# EAGLE schematic Sensor-Board_dev (EAGLE 9.6.2)

## Sheet 1 of 2
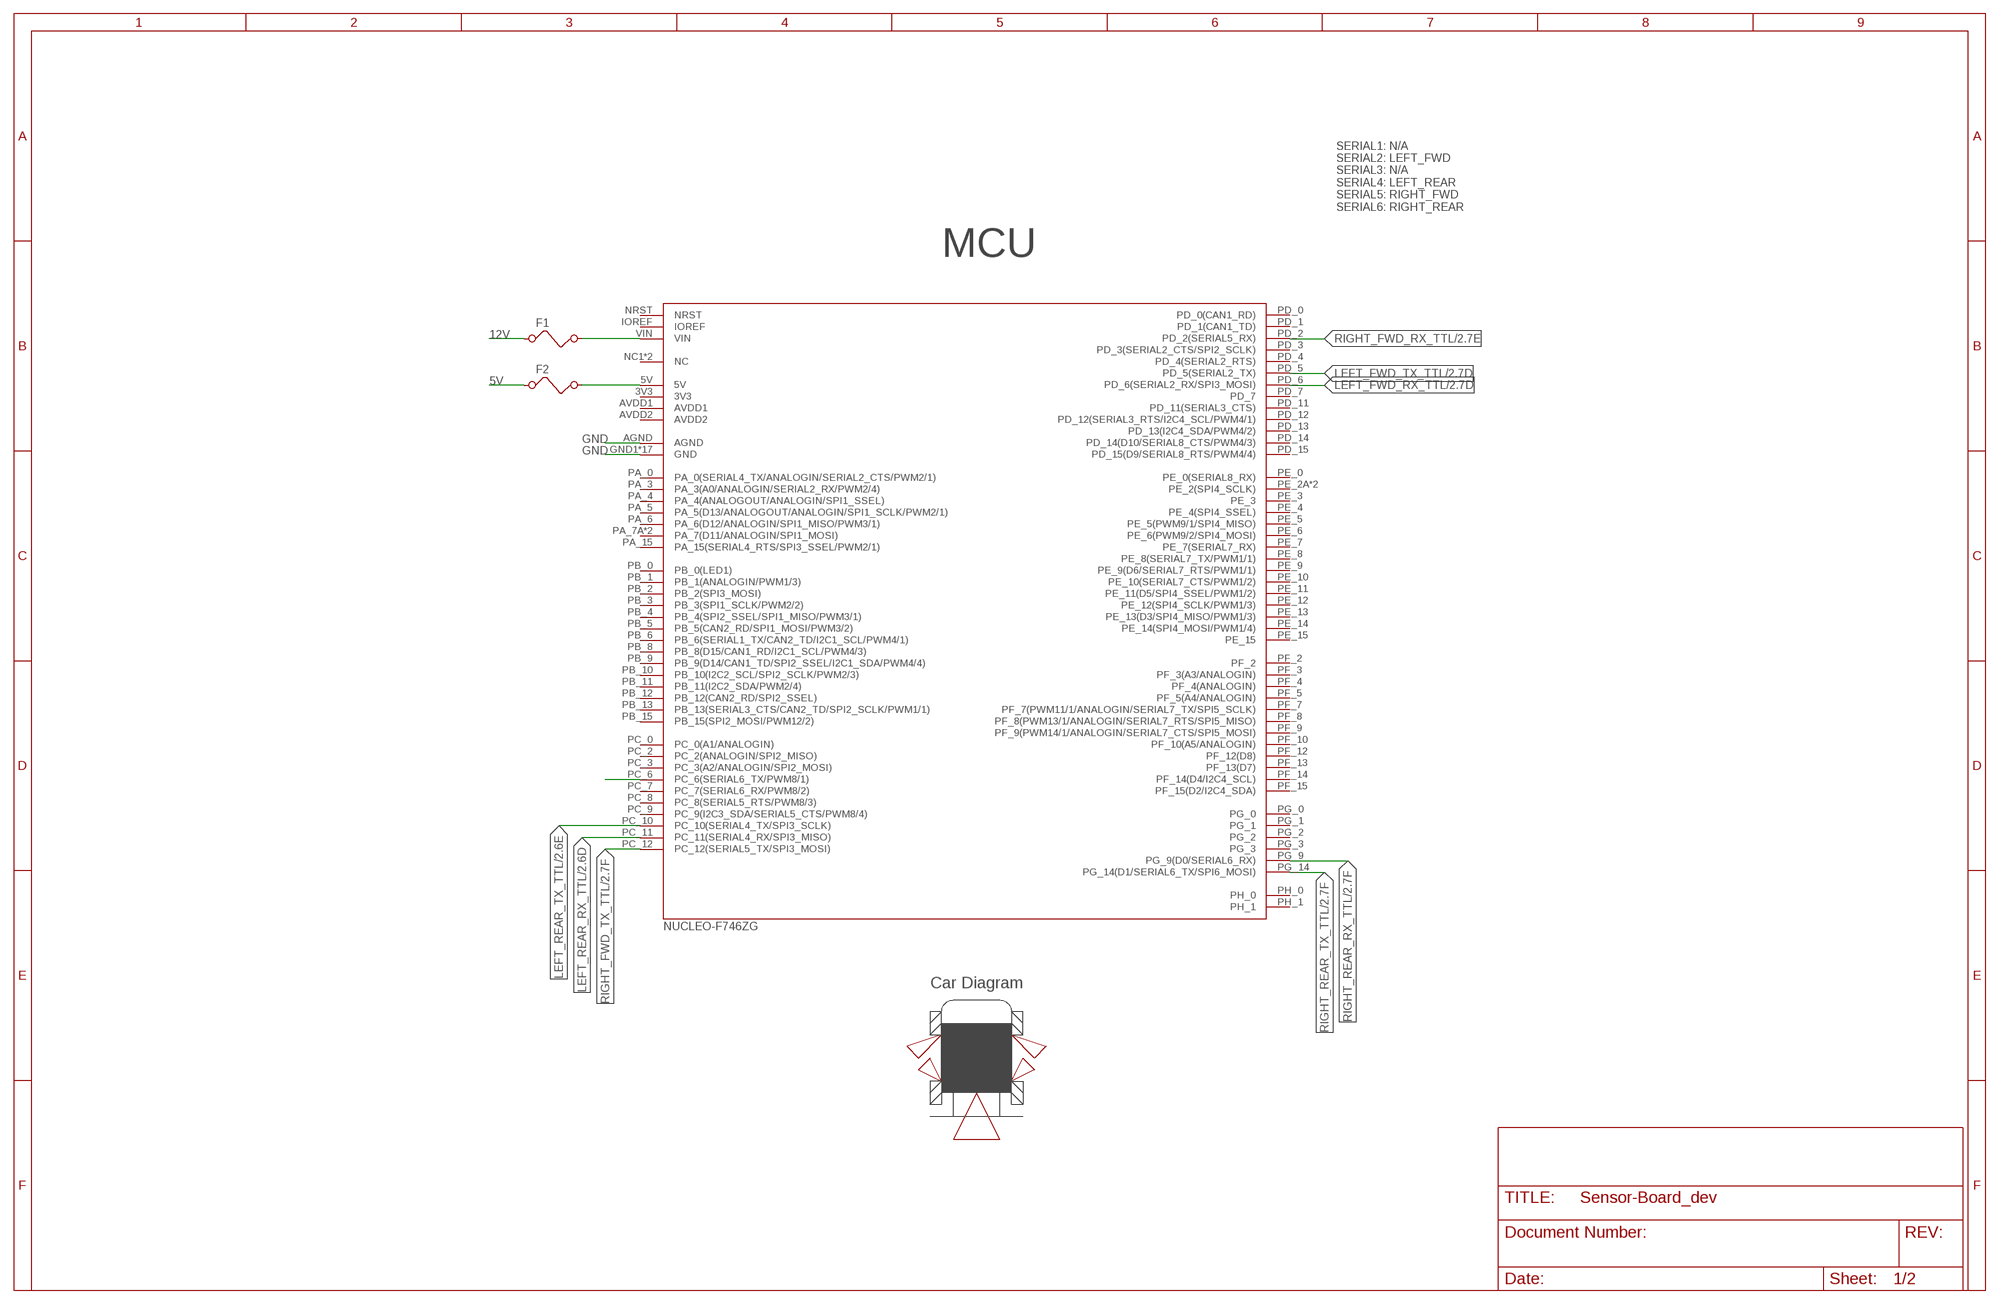
[diagram p0: schematic, sheet 1]

### Parts
F1  FUSE_1210  [1210]
F2  FUSE_1210  [1210]
UC1  NUCLEO-F746ZGNUCLEO-F746ZG  [NUCLEO-F746ZG]

### Nets
5V: F2.1 ; also sheet 2
12V: F1.1 ; also sheet 2
GND: UC1.AGND UC1.GND1(GND) UC1.GND2(GND) UC1.GND3(GND) UC1.GND4(GND) UC1.GND5(GND) UC1.GND6(GND) UC1.GND7(GND) UC1.GND8(GND) UC1.GND9(GND) UC1.GND10(GND) UC1.GND11(GND) UC1.GND12(GND) UC1.GND13(GND) UC1.GND14(GND) UC1.GND15(GND) UC1.GND16(GND) UC1.GND17(GND) ; also sheet 2
LEFT_FWD_RX_TTL: UC1.PD_6(PD_6(SERIAL2_RX/SPI3_MOSI)) ; also sheet 2
LEFT_FWD_TX_TTL: UC1.PD_5(PD_5(SERIAL2_TX)) ; also sheet 2
LEFT_REAR_RX_TTL: UC1.PC_11(PC_11(SERIAL4_RX/SPI3_MISO)) ; also sheet 2
LEFT_REAR_TX_TTL: UC1.PC_10(PC_10(SERIAL4_TX/SPI3_SCLK)) ; also sheet 2
N$8: F1.2 UC1.VIN
N$9: F2.2 UC1.5V
N$10: UC1.PC_6(PC_6(SERIAL6_TX/PWM8/1))
RIGHT_FWD_RX_TTL: UC1.PD_2(PD_2(SERIAL5_RX)) ; also sheet 2
RIGHT_FWD_TX_TTL: UC1.PC_12(PC_12(SERIAL5_TX/SPI3_MOSI)) ; also sheet 2
RIGHT_REAR_RX_TTL: UC1.PG_9(PG_9(D0/SERIAL6_RX)) ; also sheet 2
RIGHT_REAR_TX_TTL: UC1.PG_14(PG_14(D1/SERIAL6_TX/SPI6_MOSI)) ; also sheet 2
Unconnected: UC1.3V3 UC1.AVDD1 UC1.AVDD2 UC1.IOREF UC1.NC1(NC) UC1.NC2(NC) UC1.NRST UC1.PA_0(PA_0(SERIAL4_TX/ANALOGIN/SERIAL2_CTS/PWM2/1)) UC1.PA_3(PA_3(A0/ANALOGIN/SERIAL2_RX/PWM2/4)) UC1.PA_4(PA_4(ANALOGOUT/ANALOGIN/SPI1_SSEL)) UC1.PA_5(PA_5(D13/ANALOGOUT/ANALOGIN/SPI1_SCLK/PWM2/1)) UC1.PA_6(PA_6(D12/ANALOGIN/SPI1_MISO/PWM3/1)) UC1.PA_7A(PA_7(D11/ANALOGIN/SPI1_MOSI)) UC1.PA_7B(PA_7(D11/ANALOGIN/SPI1_MOSI)) UC1.PA_15(PA_15(SERIAL4_RTS/SPI3_SSEL/PWM2/1)) UC1.PB_0(PB_0(LED1)) UC1.PB_1(PB_1(ANALOGIN/PWM1/3)) UC1.PB_2(PB_2(SPI3_MOSI)) UC1.PB_3(PB_3(SPI1_SCLK/PWM2/2)) UC1.PB_4(PB_4(SPI2_SSEL/SPI1_MISO/PWM3/1)) UC1.PB_5(PB_5(CAN2_RD/SPI1_MOSI/PWM3/2)) UC1.PB_6(PB_6(SERIAL1_TX/CAN2_TD/I2C1_SCL/PWM4/1)) UC1.PB_8(PB_8(D15/CAN1_RD/I2C1_SCL/PWM4/3)) UC1.PB_9(PB_9(D14/CAN1_TD/SPI2_SSEL/I2C1_SDA/PWM4/4)) UC1.PB_10(PB_10(I2C2_SCL/SPI2_SCLK/PWM2/3)) UC1.PB_11(PB_11(I2C2_SDA/PWM2/4)) UC1.PB_12(PB_12(CAN2_RD/SPI2_SSEL)) UC1.PB_13(PB_13(SERIAL3_CTS/CAN2_TD/SPI2_SCLK/PWM1/1)) UC1.PB_15(PB_15(SPI2_MOSI/PWM12/2)) UC1.PC_0(PC_0(A1/ANALOGIN)) UC1.PC_2(PC_2(ANALOGIN/SPI2_MISO)) UC1.PC_3(PC_3(A2/ANALOGIN/SPI2_MOSI)) UC1.PC_7(PC_7(SERIAL6_RX/PWM8/2)) UC1.PC_8(PC_8(SERIAL5_RTS/PWM8/3)) UC1.PC_9(PC_9(I2C3_SDA/SERIAL5_CTS/PWM8/4)) UC1.PD_0(PD_0(CAN1_RD)) UC1.PD_1(PD_1(CAN1_TD)) UC1.PD_3(PD_3(SERIAL2_CTS/SPI2_SCLK)) UC1.PD_4(PD_4(SERIAL2_RTS)) UC1.PD_7 UC1.PD_11(PD_11(SERIAL3_CTS)) UC1.PD_12(PD_12(SERIAL3_RTS/I2C4_SCL/PWM4/1)) UC1.PD_13(PD_13(I2C4_SDA/PWM4/2)) UC1.PD_14(PD_14(D10/SERIAL8_CTS/PWM4/3)) UC1.PD_15(PD_15(D9/SERIAL8_RTS/PWM4/4)) UC1.PE_0(PE_0(SERIAL8_RX)) UC1.PE_2A(PE_2(SPI4_SCLK)) UC1.PE_2B(PE_2(SPI4_SCLK)) UC1.PE_3 UC1.PE_4(PE_4(SPI4_SSEL)) UC1.PE_5(PE_5(PWM9/1/SPI4_MISO)) UC1.PE_6(PE_6(PWM9/2/SPI4_MOSI)) UC1.PE_7(PE_7(SERIAL7_RX)) UC1.PE_8(PE_8(SERIAL7_TX/PWM1/1)) UC1.PE_9(PE_9(D6/SERIAL7_RTS/PWM1/1)) UC1.PE_10(PE_10(SERIAL7_CTS/PWM1/2)) UC1.PE_11(PE_11(D5/SPI4_SSEL/PWM1/2)) UC1.PE_12(PE_12(SPI4_SCLK/PWM1/3)) UC1.PE_13(PE_13(D3/SPI4_MISO/PWM1/3)) UC1.PE_14(PE_14(SPI4_MOSI/PWM1/4)) UC1.PE_15 UC1.PF_2 UC1.PF_3(PF_3(A3/ANALOGIN)) UC1.PF_4(PF_4(ANALOGIN)) UC1.PF_5(PF_5(A4/ANALOGIN)) UC1.PF_7(PF_7(PWM11/1/ANALOGIN/SERIAL7_TX/SPI5_SCLK)) UC1.PF_8(PF_8(PWM13/1/ANALOGIN/SERIAL7_RTS/SPI5_MISO)) UC1.PF_9(PF_9(PWM14/1/ANALOGIN/SERIAL7_CTS/SPI5_MOSI)) UC1.PF_10(PF_10(A5/ANALOGIN)) UC1.PF_12(PF_12(D8)) UC1.PF_13(PF_13(D7)) UC1.PF_14(PF_14(D4/I2C4_SCL)) UC1.PF_15(PF_15(D2/I2C4_SDA)) UC1.PG_0 UC1.PG_1 UC1.PG_2 UC1.PG_3 UC1.PH_0 UC1.PH_1

### Notes on the sheet
- SERIAL1: N/A
  SERIAL2: LEFT_FWD
  SERIAL3: N/A
  SERIAL4: LEFT_REAR
  SERIAL5: RIGHT_FWD
  SERIAL6: RIGHT_REAR
- MCU
- Car Diagram

## Sheet 2 of 2
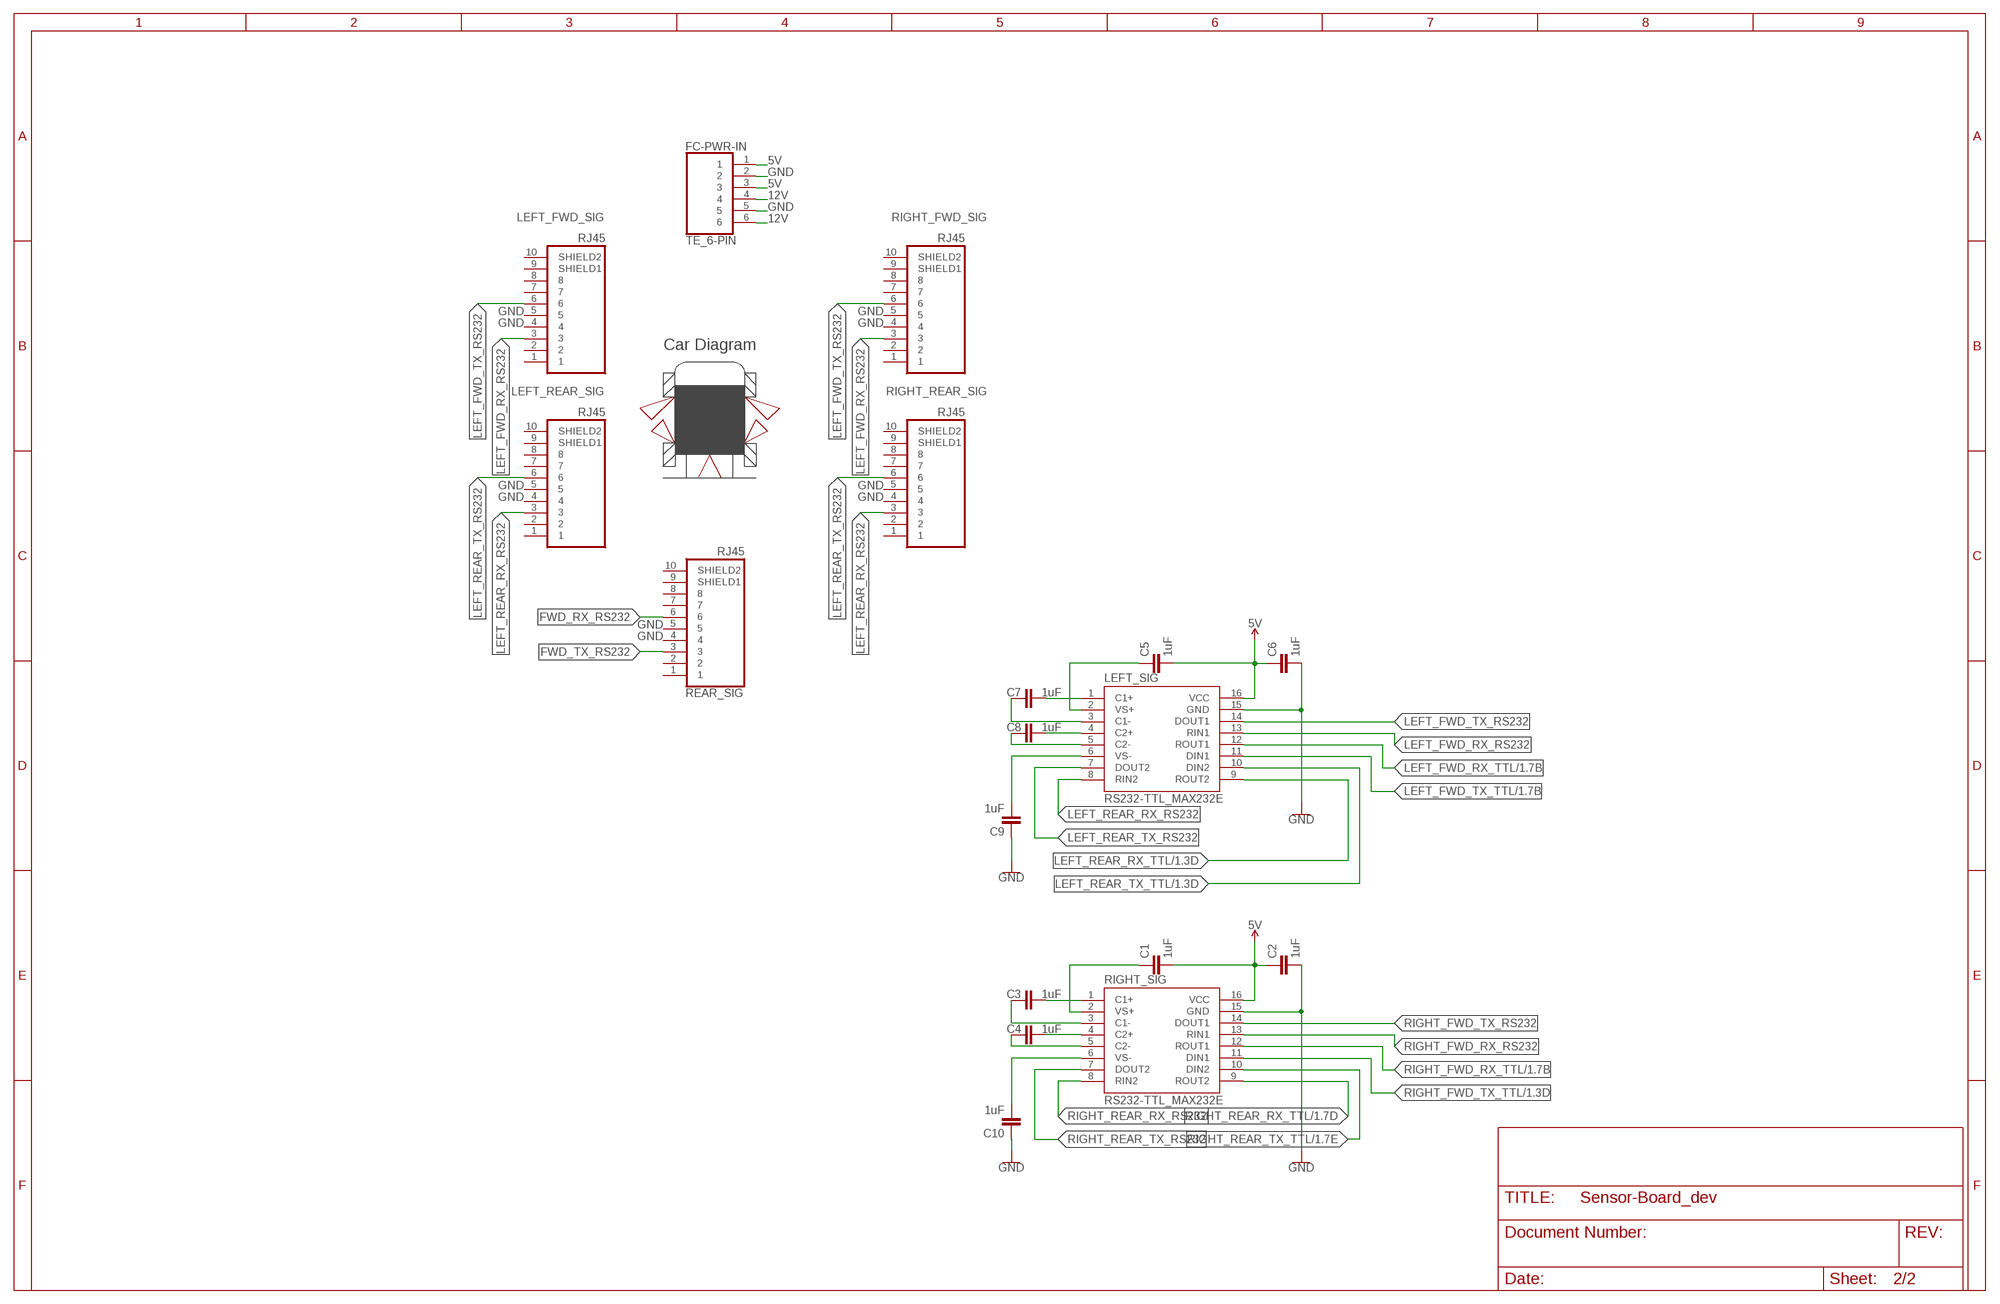
[diagram p1: schematic, sheet 2]

### Parts
C1  1uF  CAPACITOR_CERAMIC_THROUGH-HOLE  [CAP-PTH-5MM]
C2  1uF  CAPACITOR_CERAMIC_THROUGH-HOLE  [CAP-PTH-5MM]
C3  1uF  CAPACITOR_CERAMIC_THROUGH-HOLE  [CAP-PTH-5MM]
C4  1uF  CAPACITOR_CERAMIC_THROUGH-HOLE  [CAP-PTH-5MM]
C5  1uF  CAPACITOR_CERAMIC_THROUGH-HOLE  [CAP-PTH-5MM]
C6  1uF  CAPACITOR_CERAMIC_THROUGH-HOLE  [CAP-PTH-5MM]
C7  1uF  CAPACITOR_CERAMIC_THROUGH-HOLE  [CAP-PTH-5MM]
C8  1uF  CAPACITOR_CERAMIC_THROUGH-HOLE  [CAP-PTH-5MM]
C9  1uF  CAPACITOR_CERAMIC_THROUGH-HOLE  [CAP-PTH-5MM]
C10  1uF  CAPACITOR_CERAMIC_THROUGH-HOLE  [CAP-PTH-5MM]
FC-PWR-IN  TE_6-PIN  [TE_6-PIN]
LEFT_FWD_SIG  RJ45  [RJ45]
LEFT_REAR_SIG  RJ45  [RJ45]
LEFT_SIG  RS232-TTL_MAX232E  [DIP16]
REAR_SIG  RJ45  [RJ45]
RIGHT_FWD_SIG  RJ45  [RJ45]
RIGHT_REAR_SIG  RJ45  [RJ45]
RIGHT_SIG  RS232-TTL_MAX232E  [DIP16]

### Nets
5V: C1.2 C2.1 C5.2 C6.1 FC-PWR-IN.1 FC-PWR-IN.3 LEFT_SIG.16(VCC) RIGHT_SIG.16(VCC) ; also sheet 1
12V: FC-PWR-IN.4 FC-PWR-IN.6 ; also sheet 1
FWD_RX_RS232: REAR_SIG.6
FWD_TX_RS232: REAR_SIG.3
GND: C2.2 C6.2 C9.1 C10.1 FC-PWR-IN.2 FC-PWR-IN.5 LEFT_SIG.15(GND) RIGHT_SIG.15(GND) ; also sheet 1
LEFT_FWD_RX_RS232: LEFT_FWD_SIG.3 LEFT_SIG.13(RIN1) RIGHT_FWD_SIG.3
LEFT_FWD_RX_TTL: LEFT_SIG.12(ROUT1) ; also sheet 1
LEFT_FWD_TX_RS232: LEFT_FWD_SIG.6 LEFT_SIG.14(DOUT1) RIGHT_FWD_SIG.6
LEFT_FWD_TX_TTL: LEFT_SIG.11(DIN1) ; also sheet 1
LEFT_REAR_RX_RS232: LEFT_REAR_SIG.3 LEFT_SIG.8(RIN2) RIGHT_REAR_SIG.3
LEFT_REAR_RX_TTL: LEFT_SIG.9(ROUT2) ; also sheet 1
LEFT_REAR_TX_RS232: LEFT_REAR_SIG.6 LEFT_SIG.7(DOUT2) RIGHT_REAR_SIG.6
LEFT_REAR_TX_TTL: LEFT_SIG.10(DIN2) ; also sheet 1
N$1: C7.2 LEFT_SIG.1(C1+)
N$2: C1.1 RIGHT_SIG.2(VS+)
N$3: C3.1 RIGHT_SIG.3(C1-)
N$4: C4.2 RIGHT_SIG.4(C2+)
N$5: C4.1 RIGHT_SIG.5(C2-)
N$6: C10.2 RIGHT_SIG.6(VS-)
N$7: C3.2 RIGHT_SIG.1(C1+)
N$25: C5.1 LEFT_SIG.2(VS+)
N$27: C7.1 LEFT_SIG.3(C1-)
N$28: C8.2 LEFT_SIG.4(C2+)
N$29: C8.1 LEFT_SIG.5(C2-)
N$30: C9.2 LEFT_SIG.6(VS-)
RIGHT_FWD_RX_RS232: RIGHT_SIG.13(RIN1)
RIGHT_FWD_RX_TTL: RIGHT_SIG.12(ROUT1) ; also sheet 1
RIGHT_FWD_TX_RS232: RIGHT_SIG.14(DOUT1)
RIGHT_FWD_TX_TTL: RIGHT_SIG.11(DIN1) ; also sheet 1
RIGHT_REAR_RX_RS232: RIGHT_SIG.8(RIN2)
RIGHT_REAR_RX_TTL: RIGHT_SIG.9(ROUT2) ; also sheet 1
RIGHT_REAR_TX_RS232: RIGHT_SIG.7(DOUT2)
RIGHT_REAR_TX_TTL: RIGHT_SIG.10(DIN2) ; also sheet 1
Unconnected: LEFT_FWD_SIG.1 LEFT_FWD_SIG.2 LEFT_FWD_SIG.4 LEFT_FWD_SIG.5 LEFT_FWD_SIG.7 LEFT_FWD_SIG.8 LEFT_FWD_SIG.9(SHIELD1) LEFT_FWD_SIG.10(SHIELD2) LEFT_REAR_SIG.1 LEFT_REAR_SIG.2 LEFT_REAR_SIG.4 LEFT_REAR_SIG.5 LEFT_REAR_SIG.7 LEFT_REAR_SIG.8 LEFT_REAR_SIG.9(SHIELD1) LEFT_REAR_SIG.10(SHIELD2) REAR_SIG.1 REAR_SIG.2 REAR_SIG.4 REAR_SIG.5 REAR_SIG.7 REAR_SIG.8 REAR_SIG.9(SHIELD1) REAR_SIG.10(SHIELD2) RIGHT_FWD_SIG.1 RIGHT_FWD_SIG.2 RIGHT_FWD_SIG.4 RIGHT_FWD_SIG.5 RIGHT_FWD_SIG.7 RIGHT_FWD_SIG.8 RIGHT_FWD_SIG.9(SHIELD1) RIGHT_FWD_SIG.10(SHIELD2) RIGHT_REAR_SIG.1 RIGHT_REAR_SIG.2 RIGHT_REAR_SIG.4 RIGHT_REAR_SIG.5 RIGHT_REAR_SIG.7 RIGHT_REAR_SIG.8 RIGHT_REAR_SIG.9(SHIELD1) RIGHT_REAR_SIG.10(SHIELD2)

### Notes on the sheet
- Car Diagram

## Library data of the parts
C1-C10 = EcoCar-Passives:CAPACITOR_CERAMIC_THROUGH-HOLE
F1 F2 = EcoCar-Fuses-Protection:FUSE_1210: 1210 Surface Mount Fuse
FC-PWR-IN = EcoCar-Connectors:TE_6-PIN: 6 Pin TE Mini-Universal MATE-N-LOK Part Number: 1-770969-0 Digikey Part Number: A32475-ND Matching Plug: A97674-ND Matching Crimps: A100828CT-ND
LEFT_FWD_SIG LEFT_REAR_SIG REAR_SIG RIGHT_FWD_SIG RIGHT_REAR_SIG = EcoCar-Connectors:RJ45: RJ45 Connector - Use for signals and low power connections Unshielded Part Number: RJHSE-5080 Unshielded Digikey Part Number: RJHSE-5080-ND Shielded Part Number: RJHSE5E80 Shielded Digikey Part Number: RJHSE5E80-ND
LEFT_SIG RIGHT_SIG = EcoCar-Integrated-Circuits:RS232-TTL_MAX232E: Dual 5V TTL to RS-232 Converter Manufacturer: Texas Instruments Part Number: MAX232EIN Digikey Part Number: 296-27963-5-ND
UC1 = EcoCar-Microcontrollers:NUCLEO-F746ZG